# Altium schematic sheet conn_ffc_ws22_12pin.SchDoc
size A; SheetNumber: 5
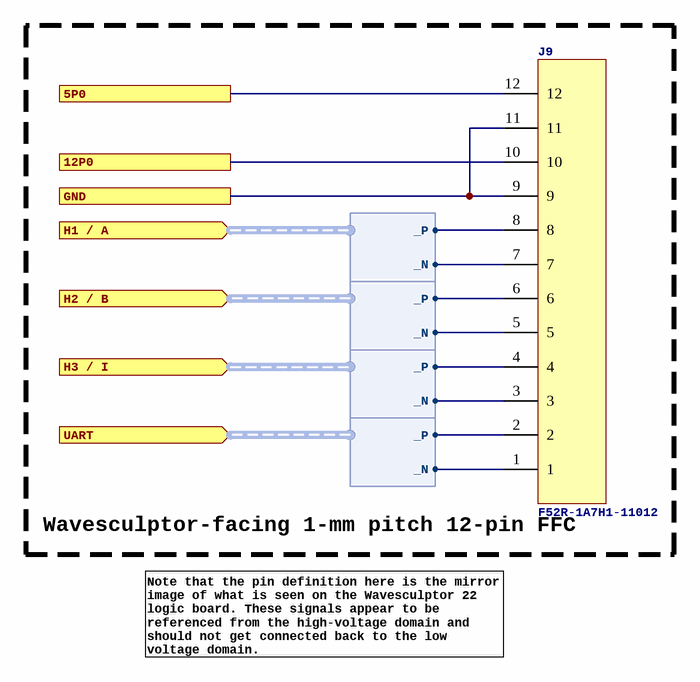
[diagram p0: conn_ffc_ws22_12pin.SchDoc]

## Parts
J9  F52R-1A7H1-11012  [AMPHENOL_F52R-1A7H1-11012]

## Blocks framed on the sheet
Wavesculptor-facing 1-mm pitch 12-pin FFC: J9

## Ports
5P0, 12P0, GND, H1 / A (in, harness DIFF), H2 / B (in, harness DIFF), H3 / I (in, harness DIFF), UART (in, harness DIFF)

## Harnesses
DIFF: _P, _N

## Nets
5P0: J9.12 ; port 5P0
12P0: J9.10 ; port 12P0
GND: J9.9 J9.11 ; port GND
NetJ9_1: J9.1 ; port UART._N
NetJ9_2: J9.2 ; port UART._P
NetJ9_3: J9.3 ; port H3 / I._N
NetJ9_4: J9.4 ; port H3 / I._P
NetJ9_5: J9.5 ; port H2 / B._N
NetJ9_6: J9.6 ; port H2 / B._P
NetJ9_7: J9.7 ; port H1 / A._N
NetJ9_8: J9.8 ; port H1 / A._P

## Notes on the sheet
- Note that the pin definition here is the mirror image of what is seen on the Wavesculptor 22 logic board. These signals appear to be referenced from the high-voltage domain and should not get connected back to the low voltage domain.

## Library data of the parts
J9 = CONN_AMPHENOL_FPC_F52R-1A7H1-11012: FPC/FFC Connector Socket 12 Position 1mm Bottom Contact Solder Right Angle Surface Mount T/R; Manufacturer: Amphenol ICC / FCI; Supplier 1: Digikey; Supplier Part Number 1: 609-F52R-1A7H1-11012CT-ND; Manufacturer Part Number: F52R-1A7H1-11012; Supplier 2: LCSC; Supplier Part Number 2: C3169442